# EAGLE design sensor cny70 (EAGLE 8.4.0)
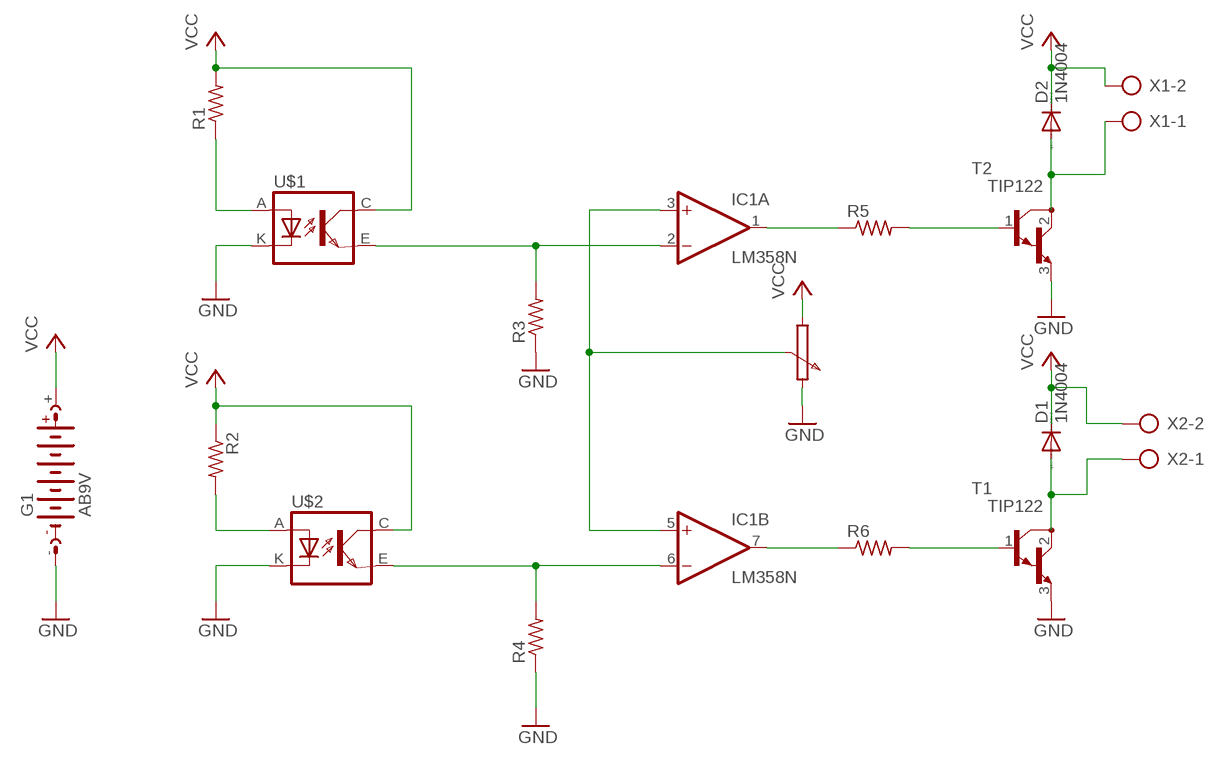
[diagram p0: schematic, sheet 1]

## Parts
D1  1N4004  [DO41-10]
D2  1N4004  [DO41-10]
G1  AB9V  [AB9V]
IC1  LM358N  [DIL08]
R1  R-US_0207/10  [0207/10]
R2  R-US_0207/10  [0207/10]
R3  R-US_0207/10  [0207/10]
R4  R-US_0207/10  [0207/10]
R5  R-US_0207/10  [0207/10]
R6  R-US_0207/10  [0207/10]
T1  TIP122  [TO220]
T2  TIP122  [TO220]
U$1  CNY70  [4]
U$2  CNY70  [4]
X1  AK500/2  [AK500/2]
X2  AK500/2  [AK500/2]

## Nets
GND: G1.- R3.1 R4.1 T1.3(E) T2.3(E) U$1.K(C) U$2.K(C)
N$1: IC1.2(A:-IN) R3.2 U$1.E(EMI)
N$2: IC1.3(A:+IN) IC1.5(B:+IN)
N$3: IC1.1(A:OUT) R5.1
N$4: IC1.7(B:OUT) R6.1
N$5: R6.2 T1.1(B)
N$6: R5.2 T2.1(B)
N$7: D1.A T1.2(C) X2.1
N$8: D2.A T2.2(C) X1.1
N$9: IC1.6(B:-IN) R4.2 U$2.E(EMI)
N$10: R1.1 U$1.A
N$11: R2.2 U$2.A
VCC: D1.C D2.C G1.+ R1.2 R2.1 U$1.C(COL) U$2.C(COL) X1.2 X2.2

## Power pins joined to a net without a drawn wire
V+: IC1.8(P:V+)
V-: IC1.4(P:V-)

## Library data of the parts
D1 D2 = diode:1N4004: DIODE general purpose rectifier, 1 A
G1 = battery:AB9V: 9-V BATTERY CLIP
IC1 = linear:LM358: OP AMP also LM158; LM258; LM2904 Source: http://cache.national.com/ds/LM/LM158.pdf
R1-R6 = rcl:R-US_: RESISTOR, American symbol
T1 T2 = transistor:TIP122: NPN BIPOLAR DARLINGTON TRANSISTOR
U$1 U$2 = cny70:CNY70
X1 X2 = con-ptr500:AK500/2: CONNECTOR; OC_FARNELL: unknown; OC_NEWARK: unknown

## Board
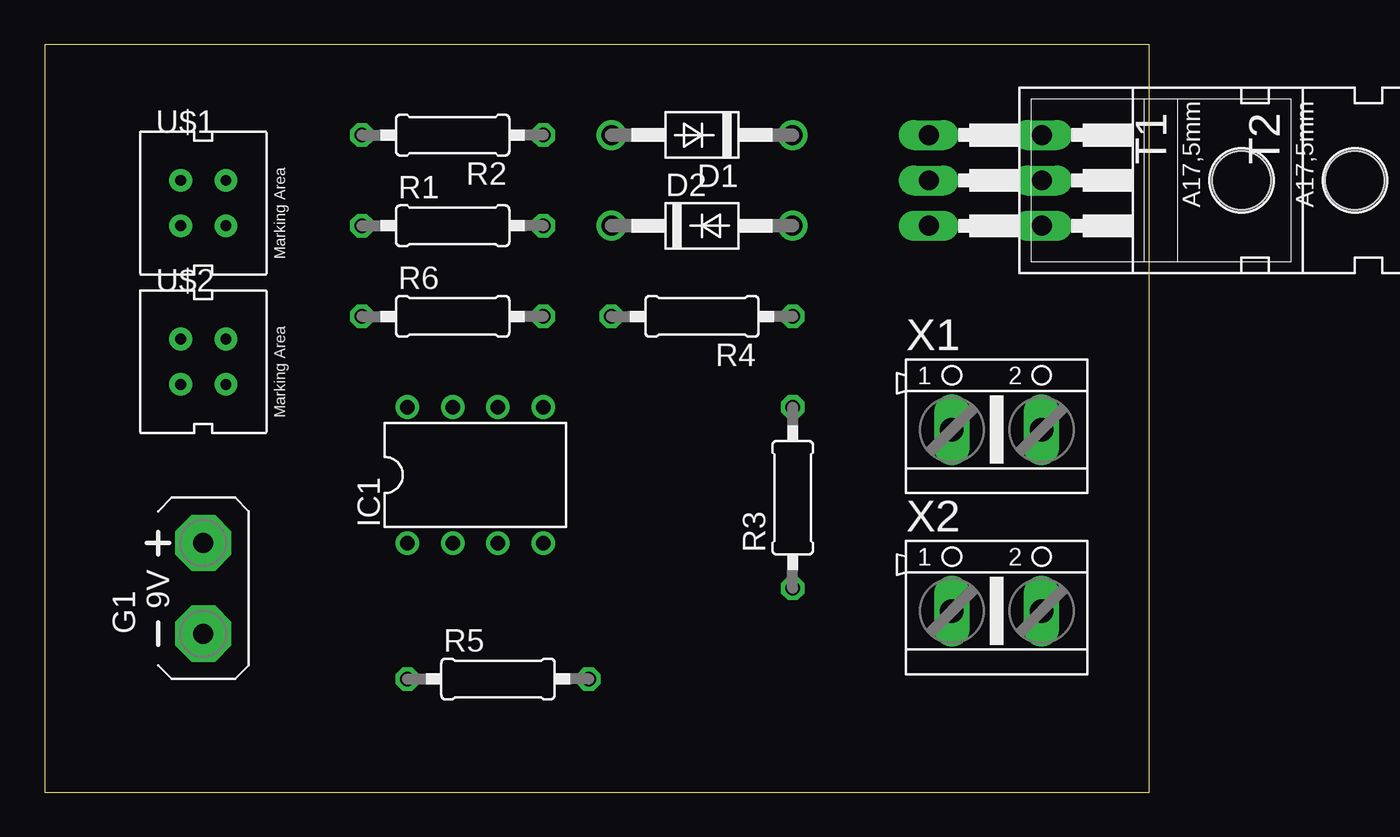
[diagram p1: board, top side]
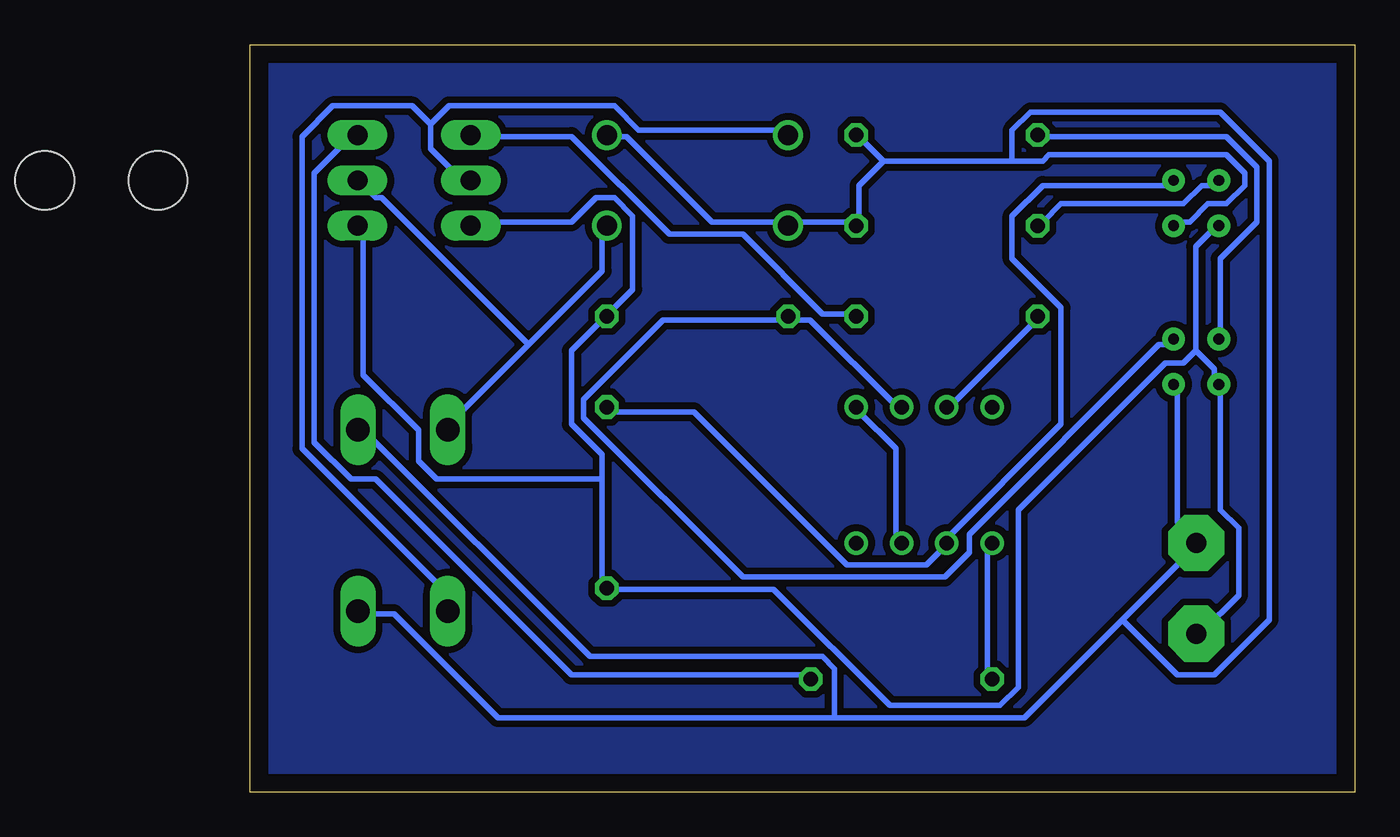
[diagram p2: board, bottom side, seen from below]

Size 61.9 x 41.9 mm. Coordinates in mm from the lower left corner, seen from the top.
Outline: 0,0 61.9,0 61.9,41.9 0,41.9 0,0
Copper layers (1*16): Top 0.035mm / dielectric 1.5mm / Bottom 0.035mm
Design rules "default *": minimum track width 30mil, minimum drill 0.35mm, track to track 15mil, track to pad 15mil, pad to pad 15mil, via to via 6mil, smd to smd 5mil, copper to edge 40mil, drill to drill 6mil, minimum pad ring 10mil, minimum via ring 8mil, stop-mask expansion 4mil, vias tented up to drill 0mil, thermal gap 10mil

### Footprints (pad centres in the part's own frame; a part is rotated, then mirrored left to right if it is on the bottom)
DO41-10 = drill 1.118: A 5.08,0; C -5.08,0
AB9V = drill 1.118 pad 3.15 octagon: + 0,2.54; - 0,-2.54
DIL08 = drill 0.813 pad 1.27: 1 -3.81,-3.81; 2 -1.27,-3.81; 3 1.27,-3.81; 4 3.81,-3.81; 5 3.81,3.81; 6 1.27,3.81; 7 -1.27,3.81; 8 -3.81,3.81
0207/10 = drill 0.813 octagon: 1 -5.08,0; 2 5.08,0
TO220 = drill 1.118 long: 1 -2.54,-6.35; 2 0,-6.35; 3 2.54,-6.35 | hole 3.302: 0,11.176
4 = drill 0.61 pad 1.27: A -1.27,1.27; C 1.27,-1.27; E 1.27,1.27; K -1.27,-1.27
AK500/2 = drill 1.321 long: 1 -2.515,0; 2 2.515,0

### Placement (x,y rotation side)
D1  36.83,36.83 180 top
D2  36.83,31.75 0 top
G1  8.89,11.43 0 top
IC1  24.13,17.78 0 top
R1  22.86,31.75 0 top
R2  22.86,36.83 180 top
R3  41.91,16.51 90 top
R4  36.83,26.67 180 top
R5  25.4,6.35 0 top
R6  22.86,26.67 0 top
T1  55.88,34.29 270 top
T2  62.23,34.29 270 top
U$1  8.89,33.02 0 top
U$2  8.89,24.13 0 top
X1  53.34,20.32 0 top
X2  53.34,10.16 0 top

### Tracks (layer width: path | path; a pad name or v marks a point on that pad's centre or on a via)
GND
  Bottom 0.305: 8.91,24.75 7.89,23.72 7.89,23.04 U$2.K 7.54,22.7 7.54,15.84 6.51,14.81 6.51,11.04 8.57,8.98 G1.- | 8.91,24.75 8.91,30.58 7.89,31.61 U$1.K | 42.18,17.55 42.18,18.92 43.89,20.64 43.89,24.75 42.18,26.47 R4.1 41.83,26.81 40.46,28.18 40.46,32.3 41.49,33.32 42.52,33.32 43.89,31.95 49.38,31.95 T1.3 | 42.18,17.55 42.18,11.72 R3.1 41.83,11.38 32.58,11.38 26.06,4.86 19.89,4.86 18.86,5.89 18.86,15.84 10.63,24.07 9.6,24.07 8.91,24.75 | 42.18,17.55 51.44,17.55 52.46,18.58 52.46,20.3 55.55,23.38 55.55,31.61 T2.3
N$1
  Bottom 0.305: U$1.E 10.29,34.01 17.49,34.01 19.2,32.3 19.2,29.9 16.46,27.15 16.46,20.64 22.97,14.12 IC1.2 22.97,13.78 24,12.75 28.46,12.75 37.03,21.32 41.83,21.32 R3.2
N$2
  Bottom 0.305: IC1.3 25.72,14.12 25.72,19.27 27.77,21.32 IC1.5
N$3
  Bottom 0.305: R5.1 20.57,6.58 20.57,13.78 IC1.1
N$4
  Bottom 0.305: IC1.7 22.63,21.67 17.83,26.47 R6.1
N$5
  Bottom 0.305: R6.2 28.12,26.81 29.83,26.81 34.29,31.27 38.41,31.27 43.89,36.75 49.38,36.75 T1.1
N$6
  Bottom 0.305: R5.2 30.52,6.58 43.89,6.58 54.86,17.55 56.24,17.55 58.29,19.61 58.29,34.7 55.89,37.1 T2.1
N$7
  Bottom 0.305: 51.78,37.44 50.75,38.47 41.49,38.47 40.12,37.1 31.89,37.1 D1.A | 51.78,37.44 51.78,36.07 49.72,34.01 T1.2 | 51.78,37.44 52.81,38.47 57.26,38.47 58.98,36.75 58.98,19.27 51.09,11.38 51.09,10.35 X2.1
N$8
  Bottom 0.305: 46.29,25.1 50.75,20.64 X1.1 | 46.29,25.1 42.18,29.21 42.18,31.61 D2.A | 46.29,25.1 54.52,33.32 54.86,33.32 55.55,34.01 T2.2
N$9
  Bottom 0.305: U$2.E 10.29,25.1 10.97,25.1 21.6,14.47 21.6,13.44 22.97,12.07 34.29,12.07 43.2,20.98 43.2,22.01 38.75,26.47 31.89,26.47 R4.2 31.55,26.47 30.52,26.47 25.72,21.67 IC1.6
N$10
  Bottom 0.305: U$1.A 7.89,34.01 8.57,34.01 9.6,32.98 16.46,32.98 17.49,31.95 R1.1
N$11
  Bottom 0.305: U$2.A 7.54,25.44 7.54,29.9 5.49,31.95 5.49,35.04 7.2,36.75 17.49,36.75 R2.2
N$12
  pour Bottom: 0,41.91 62.23,41.91 62.23,0 0,0
VCC
  Bottom 0.305: D1.C 41.83,36.75 40.8,36.75 36.01,31.95 31.89,31.95 D2.C 31.55,31.95 28.12,31.95 R1.2 27.77,31.95 27.77,34.01 26.4,35.38 | 26.4,35.38 19.2,35.38 | 19.2,35.38 17.49,35.38 17.14,35.73 7.2,35.73 6.17,34.7 6.17,34.01 7.2,32.98 8.23,32.98 9.26,31.95 9.94,31.95 U$1.C | 26.4,35.38 27.77,36.75 R2.1 | U$2.C 9.94,22.7 9.94,15.15 8.91,14.12 G1.+ 8.91,13.78 13.03,9.66 | 29.15,4.18 18.52,4.18 13.03,9.66 | 29.15,4.18 48.01,4.18 53.84,10.01 55.55,10.01 X2.2 | 29.15,4.18 29.15,6.92 29.83,7.61 42.86,7.61 55.55,20.3 X1.2 | 19.2,35.38 19.2,37.1 18.17,38.13 7.54,38.13 4.8,35.38 4.8,9.66 7.89,6.58 9.94,6.58 13.03,9.66